# EAGLE design power (EAGLE 5.11)
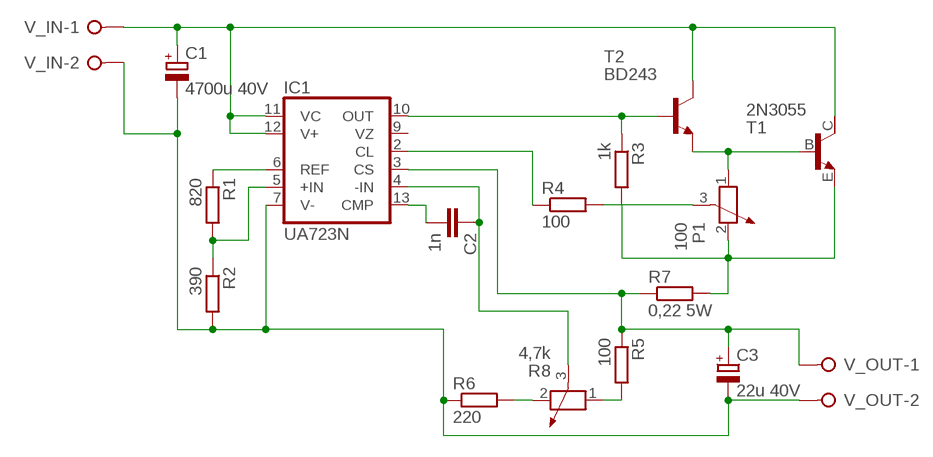
[diagram p0: schematic, sheet 1]

## Parts
C1  4700u 40V  CPOL-EUE7.5-18  [E7,5-18]
C2  1n  C-EU025-030X050  [C025-030X050]
C3  22u 40V  CPOL-EUE2,5-6E  [E2,5-6E]
IC1  UA723N  [DIL14]
P1  100  POTENTIOMETER_PT-10S  [PT-10S]
R1  820  R-EU_0207/10  [0207/10]
R2  390  R-EU_0207/10  [0207/10]
R3  1k  R-EU_0207/10  [0207/10]
R4  100  R-EU_0207/10  [0207/10]
R5  100  R-EU_0207/10  [0207/10]
R6  220  R-EU_0207/10  [0207/10]
R7  0,22 5W  R-EU_0617/22  [0617/22]
R8  4,7k  POTENTIOMETER_PT-10S  [PT-10S]
T1  2N3055  [TO3]
T2  BD243  [TO220]
V_IN  W237-02P  [W237-132]
V_OUT  W237-02P  [W237-132]

## Nets
GND: C1.- C3.- IC1.7(V-) R2.2 R6.1 V_IN.2 V_OUT.2
N$1: C2.2 IC1.13(CMP)
N$2: IC1.6(REF) R1.1
N$3: C2.1 IC1.4(-IN) R8.3
N$4: IC1.5(+IN) R1.2 R2.1
N$5: IC1.10(OUT) R3.1 T2.1(B)
N$6: P1.1 T1.B T2.3(E)
N$7: P1.2 R3.2 R7.2 T1.E
N$8: R5.2 R8.1
N$9: P1.3 R4.2
N$10: IC1.2(CL) R4.1
N$12: C3.+ IC1.3(CS) R5.1 R7.1 V_OUT.1
N$14: R6.2 R8.2
V_IN: C1.+ IC1.11(VC) IC1.12(V+) T1.C T2.2(C) V_IN.1
Unconnected: IC1.9(VZ) T1.C/(C)

## Library data of the parts
C1 C3 = resistor:CPOL-EU: POLARIZED CAPACITOR, European symbol
C2 = rcl:C-EU: CAPACITOR, European symbol
IC1 = linear:*723: Positive VOLTAGE REGULATOR
P1 R8 = rcl:POTENTIOMETER_: Potentiometer
R1-R7 = rcl:R-EU_: RESISTOR, European symbol
T1 = transistor:2N3055: NPN TRANSISTOR
T2 = transistor:BD243: NPN TRANSISTOR Source: Motorola Semiconductor, Master Selection Guide Q3/95 SG73 REV 8 page 5.5-4
V_IN V_OUT = con-wago-508:W237-02P: WAGO SREW CLAMP; OC_FARNELL: unknown; OC_NEWARK: unknown

## Board
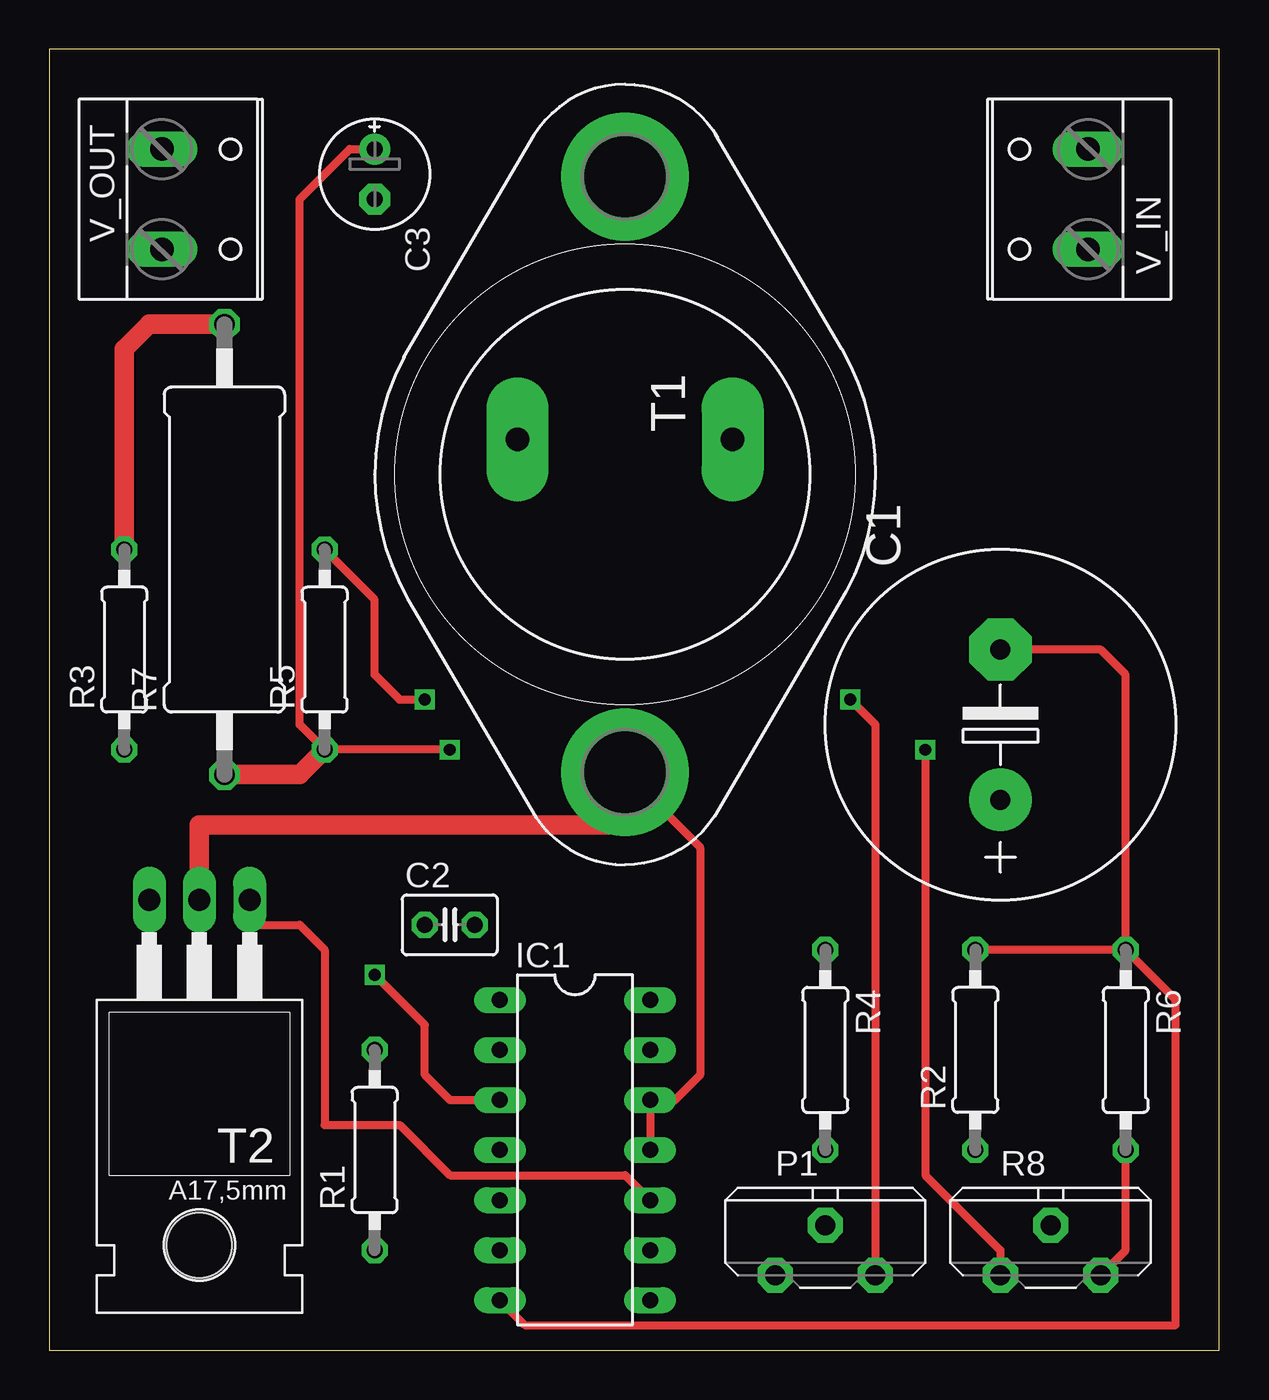
[diagram p1: board, top side]
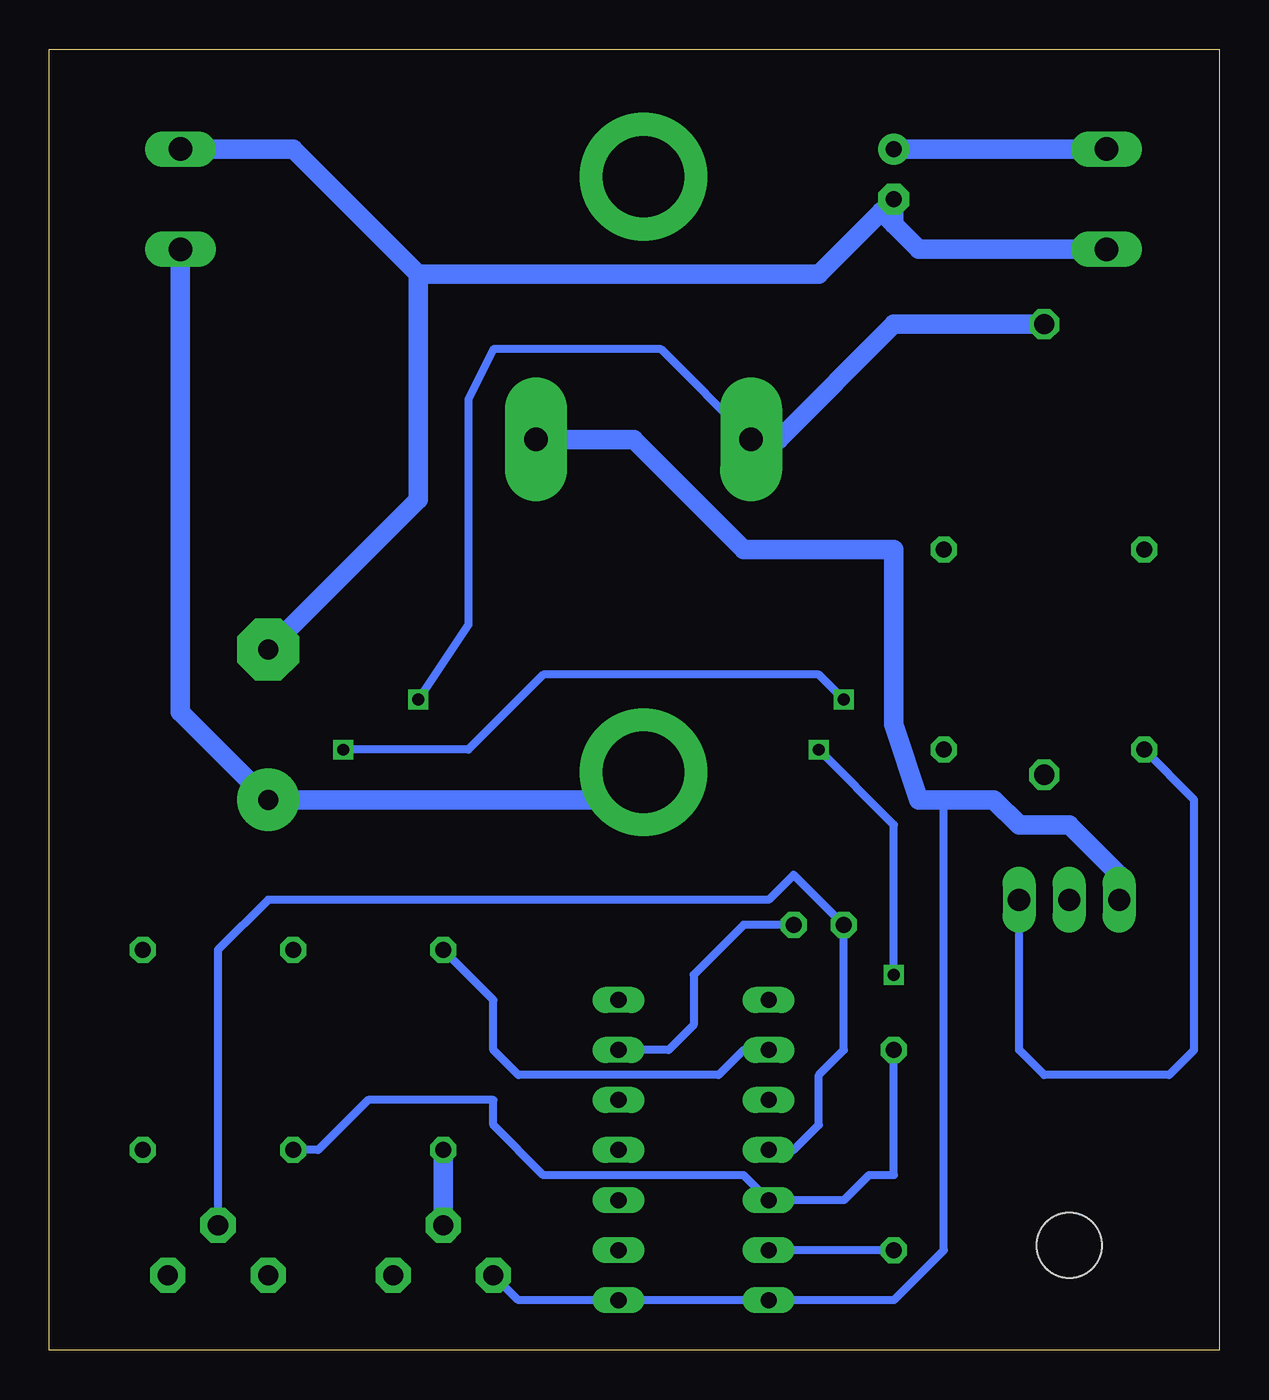
[diagram p2: board, bottom side, seen from below]

Size 59.36 x 66.03 mm. Coordinates in mm from the lower left corner, seen from the top.
Outline: 0,0 59.36,0 59.36,66.03 0,66.03 0,0
Copper layers (1*16): Top 0.035mm / dielectric 1.5mm / Bottom 0.035mm
Design rules "default": minimum track width 10mil, minimum drill 24mil, track to track 8mil, track to pad 8mil, pad to pad 8mil, via to via 8mil, smd to smd 8mil, copper to edge 40mil, drill to drill 8mil, minimum pad ring 10mil, minimum via ring 8mil, stop-mask expansion 4mil, vias tented up to drill 0mil, thermal gap 10mil

### Footprints (pad centres in the part's own frame; a part is rotated, then mirrored left to right if it is on the bottom)
E7,5-18 = drill 1.016 pad 3.15 round: + -3.81,0 | drill 1.016 pad 3.15 octagon: - 3.81,0
C025-030X050 = drill 0.813 octagon: 1 -1.27,0; 2 1.27,0
E2,5-6E = drill 0.813 pad 1.575 round: + -1.27,0 | drill 0.813 pad 1.575 octagon: - 1.27,0
DIL14 = drill 0.813 long: 1 -7.62,-3.81; 2 -5.08,-3.81; 3 -2.54,-3.81; 4 0,-3.81; 5 2.54,-3.81; 6 5.08,-3.81; 7 7.62,-3.81; 8 7.62,3.81; 9 5.08,3.81; 10 2.54,3.81; 11 0,3.81; 12 -2.54,3.81; 13 -5.08,3.81; 14 -7.62,3.81
PT-10S = drill 1.016 pad 1.778 octagon: 1 -2.54,-1.27; 2 2.54,-1.27; 3 0,1.27
0207/10 = drill 0.813 octagon: 1 -5.08,0; 2 5.08,0
0617/22 = drill 1.016 octagon: 1 -11.43,0; 2 11.43,0
TO3 = drill 1.194 pad 3.15 long: B -1.778,5.461; E -1.778,-5.461 | drill 4.115 pad 6.477 round: C 15.113,0; C/ -15.113,0
TO220 = drill 1.118 long: 1 -2.54,-6.35; 2 0,-6.35; 3 2.54,-6.35 | hole 3.302: 0,11.176
W237-132 = drill 1.194 long: 1 -2.54,-0.635; 2 2.54,-0.635

### Placement (x,y rotation side)
C1  48.26,31.75 90 top
C2  20.32,21.59 0 top
C3  16.51,59.69 270 top
IC1  26.67,10.16 270 top
P1  39.37,5.08 0 top
R1  16.51,10.16 90 top
R2  46.99,15.24 90 top
R3  3.81,35.56 90 top
R4  39.37,15.24 270 top
R5  13.97,35.56 90 top
R6  54.61,15.24 270 top
R7  8.89,40.64 90 top
R8  50.8,5.08 0 top
T1  29.21,44.45 270 top
T2  7.62,16.51 180 top
V_IN  52.07,58.42 90 top
V_OUT  6.35,58.42 270 top

### Tracks (layer width: path | path; a pad name or v marks a point on that pad's centre or on a via)
GND
  Top 0.406: C1.- 53.34,35.56 54.61,34.29 R6.1 | R6.1 R2.2 | IC1.7 24.13,1.27 57.15,1.27 57.15,17.78 R6.1
  Bottom 1: V_IN.2 46.99,60.96 40.64,54.61 | 40.64,54.61 20.32,54.61 17.14,57.78 | 17.14,57.78 C3.- 16.51,57.15 | 17.14,57.78 16.51,57.15 | 40.64,54.61 40.64,43.18 C1.- | V_OUT.2 15.24,55.88 16.51,57.15
N$1
  Bottom 0.406: C2.2 24.13,21.59 26.67,19.05 26.67,16.51 27.94,15.24 IC1.13
N$2
  Bottom 0.406: R1.1 IC1.6
N$3
  Bottom 0.406: IC1.4 21.59,10.16 20.32,11.43 20.32,13.97 19.05,15.24 C2.1 21.59,24.13 22.86,22.86 48.26,22.86 50.8,20.32 R8.3
N$4
  Bottom 0.406: R1.2 16.51,8.89 17.78,8.89 19.05,7.62 IC1.5 24.13,8.89 34.29,8.89 36.83,11.43 36.83,12.7 43.18,12.7 45.72,10.16 R2.1
N$5
  Top 0.406: IC1.10 29.21,8.89 20.32,8.89 17.78,11.43 13.97,11.43 13.97,20.32 12.7,21.59 10.16,21.59 T2.1
  Bottom 0.406: R3.1 1.27,27.94 1.27,15.24 2.54,13.97 8.89,13.97 10.16,15.24 T2.1
N$6
  Bottom 0.406: P1.1 35.56,2.54 16.51,2.54 13.97,5.08 13.97,27.94
  Bottom 1: T1.B 29.72,46.23 24.13,40.64 16.51,40.64 16.51,31.75 15.24,27.94 13.97,27.94 11.43,27.94 10.16,26.67 7.62,26.67 5.08,24.13 T2.3
N$7  (via drill 0.6)
  Top 0.406: v40.64,33.02 41.91,31.75 P1.2
  Top 1: R7.2 5.08,52.07 3.81,50.8 R3.2
  Bottom 0.406: T1.E 28.32,50.8 36.83,50.8 38.1,48.26 38.1,36.83 v40.64,33.02
  Bottom 1: T1.E 22.35,46.23 16.51,52.07 R7.2
N$8  (via drill 0.6)
  Top 0.406: R5.2 16.51,38.1 16.51,34.29 17.78,33.02 v19.05,33.02 | v44.45,30.48 44.45,8.89 48.26,5.08 R8.1
  Bottom 0.406: v19.05,33.02 20.32,34.29 34.29,34.29 38.1,30.48 v44.45,30.48
N$9
  Bottom 1: P1.3 R4.2
N$10
  Bottom 0.406: R4.1 36.83,17.78 36.83,15.24 35.56,13.97 25.4,13.97 24.13,15.24 IC1.2
N$12  (via drill 0.6)
  Top 0.406: C3.+ 15.24,60.96 12.7,58.42 12.7,31.75 R5.1 v20.32,30.48 | v16.51,19.05 19.05,16.51 19.05,13.97 20.32,12.7 IC1.3
  Top 1: R7.1 12.7,29.21 R5.1
  Bottom 0.406: v20.32,30.48 16.51,26.67 v16.51,19.05
  Bottom 1: C3.+ V_OUT.1
N$14
  Top 0.406: R6.2 54.61,5.08 R8.2
V_IN
  Top 0.406: T1.C 33.02,25.53 33.02,13.97 31.75,12.7 IC1.12 IC1.11
  Top 1: T2.2 7.62,26.67 29.21,26.67 T1.C
  Bottom 1: V_IN.1 52.7,32.38 C1.+ 30.61,27.94 T1.C